# Altium schematic sheet Title.SchDoc: Title Sheet
size Letter; Revision: 1.0; SheetNumber: 1; PageSetup: Record=PageOptions|CenterHorizontal=True|CenterVertical=True|PrintScale=1.00|XCorrection=1.00|YCorrection=1.00|PrintKind=1|BorderSize=5000000|LeftOffset=0|BottomOffset=0|Orientation=2|PaperLength=1000|PaperWidth=1000|Scale=100|PaperSource=7|PrintQuality=-3|MediaType=1|DitherType=10|PrintScaleMode=1|PaperKind=Letter|PaperIndex=1; ProjectTitle: Data Acquisition System
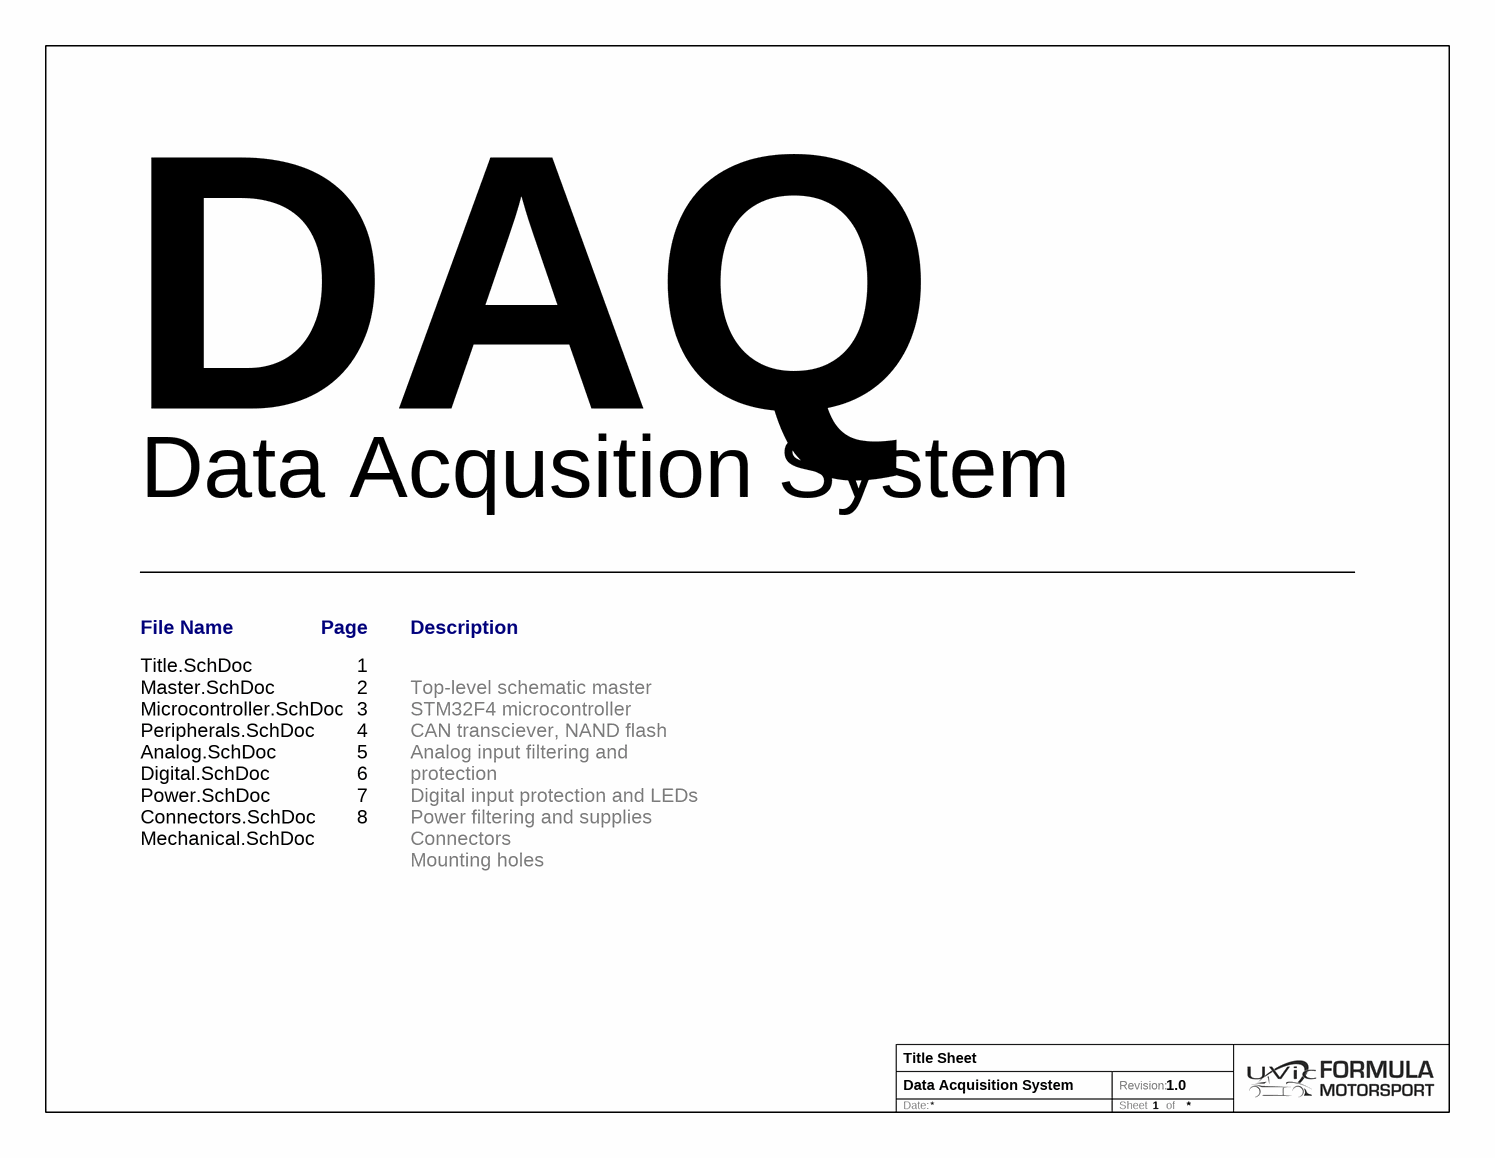
[diagram p0: Title.SchDoc]

## Notes on the sheet
- DAQ
- Data Acqusition System
- File Name
- Page
- Description
- 1
  2
  3
  4
  5
  6
  7
  8
  9
- Title.SchDoc
  Master.SchDoc
  Microcontroller.SchDoc
  Peripherals.SchDoc
  Analog.SchDoc
  Digital.SchDoc
  Power.SchDoc
  Connectors.SchDoc
  Mechanical.SchDoc
- Top-level schematic master
  STM32F4 microcontroller
  CAN transciever, NAND flash
  Analog input filtering and protection
  Digital input protection and LEDs
  Power filtering and supplies
  Connectors
  Mounting holes
- Date:
- Revision:
- Sheet
- of